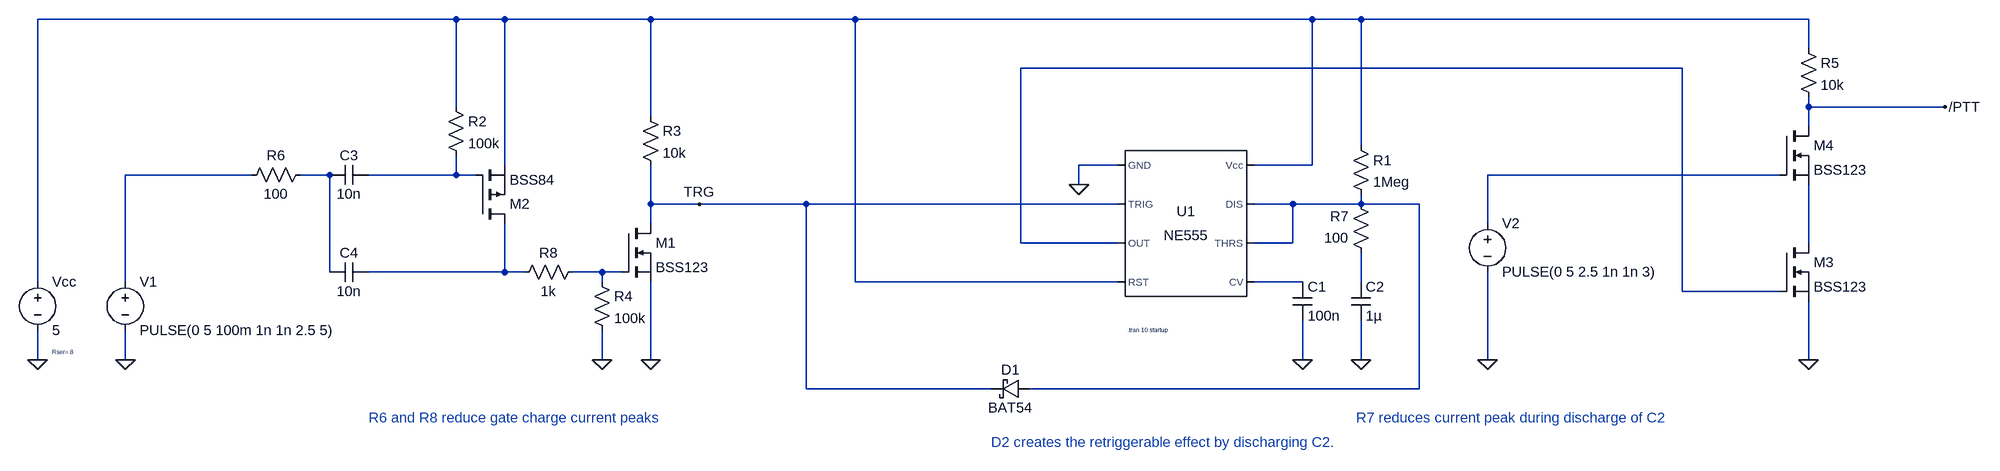
[diagram p0: schematic 555Monostable_retriggerable_timer.asc]
555Monostable_retriggerable_timer.asc, the LTspice schematic file:
Version 4
SHEET 1 1420 680
WIRE -1104 -80 -1792 -80
WIRE -1024 -80 -1104 -80
WIRE -784 -80 -1024 -80
WIRE -448 -80 -784 -80
WIRE 304 -80 -448 -80
WIRE 384 -80 304 -80
WIRE 1120 -80 384 -80
WIRE 1120 -32 1120 -80
WIRE 912 0 -176 0
WIRE -1104 64 -1104 -80
WIRE 1120 64 1120 48
WIRE 1344 64 1120 64
WIRE -784 80 -784 -80
WIRE 1120 96 1120 64
WIRE 384 128 384 -80
WIRE -1024 160 -1024 -80
WIRE -16 160 -80 160
WIRE 304 160 304 -80
WIRE 304 160 208 160
WIRE -1440 176 -1648 176
WIRE -1312 176 -1360 176
WIRE -1104 176 -1104 144
WIRE -1104 176 -1248 176
WIRE -1072 176 -1104 176
WIRE 1072 176 592 176
WIRE -80 192 -80 160
WIRE -784 224 -784 160
WIRE -704 224 -784 224
WIRE -528 224 -704 224
WIRE -16 224 -528 224
WIRE 272 224 208 224
WIRE 384 224 384 208
WIRE 384 224 272 224
WIRE 480 224 384 224
WIRE -784 256 -784 224
WIRE 592 256 592 176
WIRE -176 288 -176 0
WIRE -16 288 -176 288
WIRE 272 288 272 224
WIRE 272 288 208 288
WIRE 1120 288 1120 192
WIRE -1312 336 -1312 176
WIRE -1024 336 -1024 256
WIRE -1024 336 -1248 336
WIRE -992 336 -1024 336
WIRE -864 336 -912 336
WIRE -832 336 -864 336
WIRE -1792 352 -1792 -80
WIRE -1648 352 -1648 176
WIRE -864 352 -864 336
WIRE -448 352 -448 -80
WIRE -16 352 -448 352
WIRE 288 352 208 352
WIRE 384 352 384 304
WIRE 912 368 912 0
WIRE 1072 368 912 368
WIRE -1792 480 -1792 432
WIRE -1648 480 -1648 432
WIRE -864 480 -864 432
WIRE -784 480 -784 352
WIRE 288 480 288 416
WIRE 384 480 384 416
WIRE 592 480 592 336
WIRE 1120 480 1120 384
WIRE -528 528 -528 224
WIRE -224 528 -528 528
WIRE 480 528 480 224
WIRE 480 528 -160 528
FLAG -80 192 0
FLAG 288 480 0
FLAG 384 480 0
FLAG -1792 480 0
FLAG -1648 480 0
FLAG -864 480 0
FLAG -784 480 0
FLAG -704 224 TRG
FLAG 1120 480 0
FLAG 592 480 0
FLAG 1344 64 /PTT
SYMBOL Misc\\NE555 96 256 R0
SYMATTR InstName U1
SYMBOL cap 272 352 R0
SYMATTR InstName C1
SYMATTR Value 100n
SYMBOL res 368 112 R0
SYMATTR InstName R1
SYMATTR Value 1Meg
SYMATTR SpiceLine tol=1 pwr=0.1
SYMBOL cap 368 352 R0
SYMATTR InstName C2
SYMATTR Value 1µ
SYMATTR SpiceLine V=25 Irms=0 Rser=0.007 MTBF=0 Lser=0 ppPkg=1
SYMBOL voltage -1792 336 R0
WINDOW 123 0 0 Left 0
WINDOW 39 24 132 Left 0
SYMATTR SpiceLine Rser=.8
SYMATTR InstName Vcc
SYMATTR Value 5
SYMBOL voltage -1648 336 R0
WINDOW 123 0 0 Left 0
WINDOW 39 0 0 Left 0
SYMATTR InstName V1
SYMATTR Value PULSE(0 5 100m 1n 1n 2.5 5)
SYMBOL cap -1248 160 R90
WINDOW 0 0 32 VBottom 2
WINDOW 3 32 32 VTop 2
SYMATTR InstName C3
SYMATTR Value 10n
SYMBOL res -1120 48 R0
SYMATTR InstName R2
SYMATTR Value 100k
SYMBOL nmos -832 256 R0
SYMATTR InstName M1
SYMATTR Value BSS123
SYMBOL cap -1248 320 R90
WINDOW 0 0 32 VBottom 2
WINDOW 3 32 32 VTop 2
SYMATTR InstName C4
SYMATTR Value 10n
SYMBOL res -880 336 R0
SYMATTR InstName R4
SYMATTR Value 100k
SYMBOL pmos -1072 256 M180
SYMATTR InstName M2
SYMATTR Value BSS84
SYMBOL res -800 64 R0
SYMATTR InstName R3
SYMATTR Value 10k
SYMBOL schottky -160 512 R90
WINDOW 0 0 32 VBottom 2
WINDOW 3 32 32 VTop 2
SYMATTR InstName D1
SYMATTR Value BAT54
SYMATTR Description Diode
SYMATTR Type diode
SYMBOL nmos 1072 288 R0
SYMATTR InstName M3
SYMATTR Value BSS123
SYMBOL nmos 1072 96 R0
SYMATTR InstName M4
SYMATTR Value BSS123
SYMBOL voltage 592 240 R0
WINDOW 123 0 0 Left 0
WINDOW 39 0 0 Left 0
SYMATTR InstName V2
SYMATTR Value PULSE(0 5 2.5 1n 1n 3)
SYMBOL res 1104 -48 R0
SYMATTR InstName R5
SYMATTR Value 10k
SYMBOL res -1344 160 R90
WINDOW 0 0 56 VBottom 2
WINDOW 3 32 56 VTop 2
SYMATTR InstName R6
SYMATTR Value 100
SYMBOL res 400 320 R180
WINDOW 0 36 76 Left 2
WINDOW 3 36 40 Left 2
SYMATTR InstName R7
SYMATTR Value 100
SYMBOL res -896 320 R90
WINDOW 0 0 56 VBottom 2
WINDOW 3 32 56 VTop 2
SYMATTR InstName R8
SYMATTR Value 1k
TEXT 0 432 Left 0 !.tran 10 startup
TEXT 376 576 Left 2 ;R7 reduces current peak during discharge of C2
TEXT -224 616 Left 2 ;D2 creates the retriggerable effect by discharging C2.
TEXT -1248 576 Left 2 ;R6 and R8 reduce gate charge current peaks

The netlist it stands for:
* 555Monostable_retriggerable_timer.asc
XU1 0 TRG N002 N001 N011 N007 N007 N001 NE555  ; pins GND TRIG OUT RST CV THRS DIS Vcc
C1 N011 0 100n
R1 N001 N007 1Meg tol=1 pwr=0.1
C2 N012 0 1µ V=25 Irms=0 Rser=0.007 MTBF=0 Lser=0 ppPkg=1
Vcc N001 0 5 Rser=.8
V1 N003 0 PULSE(0 5 100m 1n 1n 2.5 5)
C3 N005 N004 10n
R2 N001 N005 100k
M1 TRG N010 0 0 BSS123
C4 N009 N004 10n
R4 N010 0 100k
M2 N009 N005 N001 N001 BSS84
R3 N001 TRG 10k
D1 N007 TRG BAT54
M3 N008 N002 0 0 BSS123
M4 /PTT N006 N008 N008 BSS123
V2 N006 0 PULSE(0 5 2.5 1n 1n 3)
R5 N001 /PTT 10k
R6 N004 N003 100
R7 N012 N007 100
R8 N010 N009 1k
.model D D
.lib standard.dio
.model NMOS NMOS
.model PMOS PMOS
.lib standard.mos
.tran 10 startup
* R7 reduces current peak during discharge of C2
* D2 creates the retriggerable effect by discharging C2.
* R6 and R8 reduce gate charge current peaks
.lib NE555.sub
.backanno
.end

* Results of the author's LTspice run, read from the files saved beside the schematic
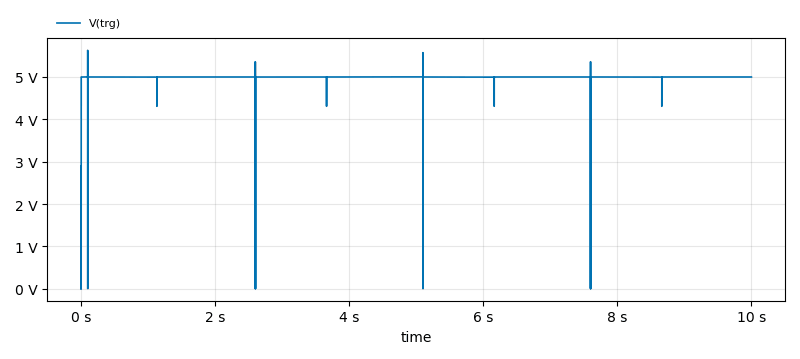
[diagram p1: Transient Analysis of 555Monostable_retriggerable_timer.asc, plotted from the saved traces]
* Transient Analysis, 1 run:
*   V(trg): min 0 V, max 5.626 V, average 4.993 V, rms 4.995 V, last 4.998 V